# Altium schematic sheet Half_Bridge_Driver.SchDoc
size A; SheetNumber: 7; SheetTotal: 7
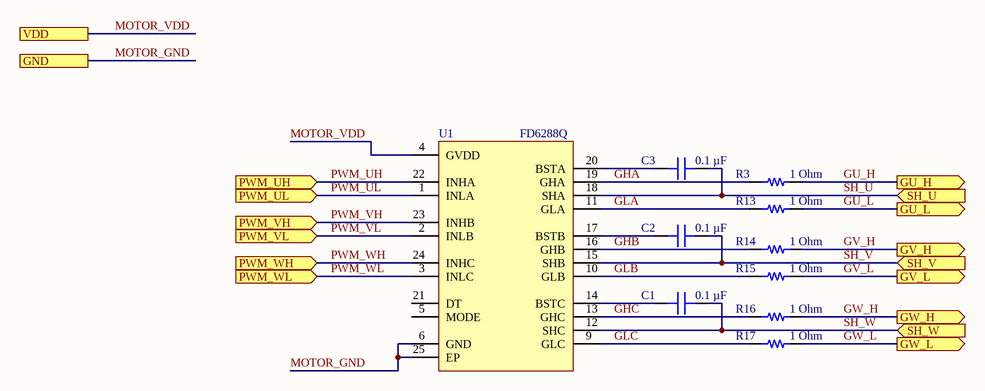
[diagram p0: Half_Bridge_Driver.SchDoc]

## Parts
C1  0.1 µF  [CAP 0402_1005]
C2  0.1 µF  [CAP 0402_1005]
C3  0.1 µF  [CAP 0402_1005]
R3  1 Ohm  [RES 0402_1005]
R13  1 Ohm  [RES 0402_1005]
R14  1 Ohm  [RES 0402_1005]
R15  1 Ohm  [RES 0402_1005]
R16  1 Ohm  [RES 0402_1005]
R17  1 Ohm  [RES 0402_1005]
U1  FD6288Q  [QFN50P400X400X100-25N]

## Ports
GND, GU_H (out), GU_L (out), GV_H (out), GV_L (out), GW_H (out), GW_L (out), PWM_UH (in), PWM_UL (in), PWM_VH (in), PWM_VL (in), PWM_WH (in), PWM_WL (in), SH_U (in), SH_V (in), SH_W (in), VDD

## Nets
GHA: R3.1 U1.19(GHA)
GHB: R14.1 U1.16(GHB)
GHC: R16.1 U1.13(GHC)
GLA: R13.1 U1.11(GLA)
GLB: R15.1 U1.10(GLB)
GLC: R17.1 U1.9(GLC)
GU_H: R3.2 ; port GU_H
GU_L: R13.2 ; port GU_L
GV_H: R14.2 ; port GV_H
GV_L: R15.2 ; port GV_L
GW_H: R16.2 ; port GW_H
GW_L: R17.2 ; port GW_L
MOTOR_GND: U1.6(GND) U1.25(EP) ; port GND
MOTOR_VDD: U1.4(GVDD) ; port VDD
PWM_UH: U1.22(INHA) ; port PWM_UH
PWM_UL: U1.1(INLA) ; port PWM_UL
PWM_VH: U1.23(INHB) ; port PWM_VH
PWM_VL: U1.2(INLB) ; port PWM_VL
PWM_WH: U1.24(INHC) ; port PWM_WH
PWM_WL: U1.3(INLC) ; port PWM_WL
SH_U: C3.2 U1.18(SHA) ; port SH_U
SH_V: C2.2 U1.15(SHB) ; port SH_V
SH_W: C1.2 U1.12(SHC) ; port SH_W
NetC1_1: C1.1 U1.14(BSTC)
NetC2_1: C2.1 U1.17(BSTB)
NetC3_1: C3.1 U1.20(BSTA)

Not connected (* = marked no-connect by the designer): U1 5(MODE) 21(DT)

## Library data of the parts
C1-C3 = C0402C104K4RACAUTO: CAP CER 0.1UF 16V X7R 0402; manufacturer: KEMET; Tolerance: ±10%; Part Number: C0402C104K4RACAUTO; Value: 0.1 µF; Applications: Automotive, Bypass, Decoupling; Capacitance: 0.1 µF; componentlink1description: Datasheet; componentlink1url: https://api.kemet.com/component-edge/download/specsheet/C0402C104K4RACAUTO.pdf; componentlink2description: DigiKey Link; componentlink2url: https://www.digikey.com/en/products/detail/kemet/C0402C104K4RACAUTO/3314827; Device Package: 0402 (1005 Metric); lastupdated: 8/14/2022 9:05:51 PM; Lifecycle Status: Active; Minimum Order: 1; Mounting Type: Surface Mount, MLCC; Operating Temperature: -55°C ~ 125°C; Package / Case: 0402 (1005 Metric); packaging: TapeAndReel; partid: 3024; Part Status: Active; price: 0.01; Ratings: AEC-Q200; series: SMD Auto X7R; Size / Dimension: 0.039" L x 0.020" W (1.00mm x 0.50mm); Supplier 1: DigiKey; Supplier Part Number 1: 399-6828-1-ND; Temperature Coefficient: X7R; Thickness (Max): 0.022" (0.55mm); Voltage - Rated: 16V
R3 R13-R17 = RK73H1ETTP1432F: RES 14.3K OHM 1% 1/10W 0402; Manufacturer: KOA Speer Electronics, Inc.; Power (Watts): 0.1W, 1/10W; Resistance: 14.3 kOhms; Temperature Coefficient: ±100ppm/°C; Part Number: RK73H1ETTP1432F; Value: 1 Ohm; ComponentLink1Description: Datasheet; ComponentLink1URL: http://www.koaspeer.com/catimages/Products/RK73H/RK73H.pdf; ComponentLink2Description: DigiKey Link; ComponentLink2URL: https://www.digikey.com/en/products/detail/koa-speer-electronics-inc/RK73H1ETTP1432F/9844351; Composition: Thick Film; Device Package: 0402 (1005 Metric); Features: Automotive AEC-Q200, Moisture Resistant; Height - Seated (Max): 0.016" (0.40mm); LastUpdated: 8/14/2022 9:23:49 PM; Lifecycle Status: Active; Minimum Order: 1; Number of Terminations: 2; Operating Temperature: -55°C ~ 155°C; Package / Case: 0402 (1005 Metric); Packaging: CutTape; PartId: 10193; Part Status: Active; Price: 0.01; Ratings: AEC-Q200; Series: RK73H; Size / Dimension: 0.039" L x 0.020" W (1.00mm x 0.50mm); Supplier 1: DigiKey; Supplier Part Number 1: 2019-RK73H1ETTP1432FCT-ND; Supplier Device Package: 0402; Tolerance: ±1%
U1 = FD6288Q: 3 Phase Gate Driver 1.5-2.2A; MF: Texas Instruments; MP: UCC27282DRCR; Texas_Instruments-Purchase-URL: https://snapeda.com/shop?store=Texas+Instruments&id=3625400; Price: None; Availability: Warning; Package: VSON-10 Texas Instruments; SnapEDA_Link: https://www.snapeda.com/parts/UCC27282DRCR/Texas%20Instruments/view-part/3625400/?ref=snap; DigiKey-Purchase-URL: https://snapeda.com/shop?store=DigiKey&id=3625400; Value: *